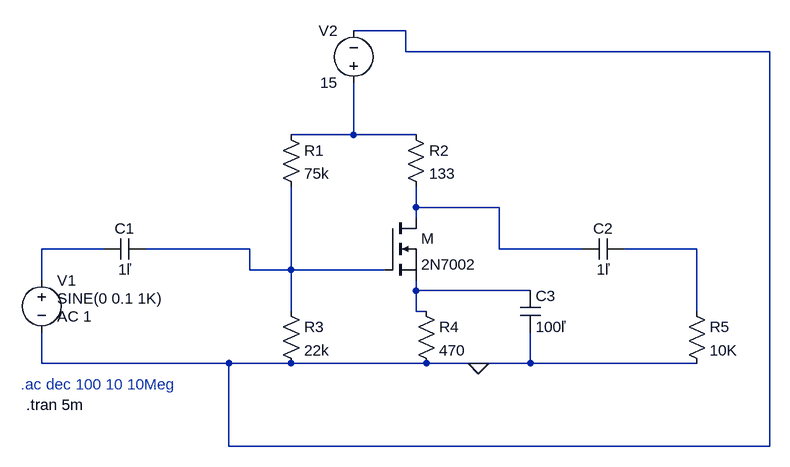
[diagram p0: schematic NNM24EE003_AdarshPoojary.asc]
NNM24EE003_AdarshPoojary.asc, the LTspice schematic file:
Version 4.1
SHEET 1 880 680
WIRE -1200 -752 -1280 -752
WIRE -1200 -720 -1200 -752
WIRE -640 -720 -1200 -720
WIRE -1280 -592 -1280 -672
WIRE -1280 -592 -1376 -592
WIRE -1184 -592 -1280 -592
WIRE -1184 -480 -1184 -512
WIRE -1056 -480 -1184 -480
WIRE -1184 -464 -1184 -480
WIRE -1664 -416 -1760 -416
WIRE -1440 -416 -1600 -416
WIRE -1056 -416 -1056 -480
WIRE -928 -416 -1056 -416
WIRE -752 -416 -864 -416
WIRE -1440 -384 -1440 -416
WIRE -1376 -384 -1376 -512
WIRE -1376 -384 -1440 -384
WIRE -1232 -384 -1376 -384
WIRE -1760 -368 -1760 -416
WIRE -1184 -352 -1184 -368
WIRE -1008 -352 -1184 -352
WIRE -1376 -320 -1376 -384
WIRE -1184 -320 -1184 -352
WIRE -1168 -320 -1184 -320
WIRE -752 -320 -752 -416
WIRE -1760 -240 -1760 -288
WIRE -1472 -240 -1760 -240
WIRE -1376 -240 -1472 -240
WIRE -1168 -240 -1376 -240
WIRE -1088 -240 -1168 -240
WIRE -1008 -240 -1008 -288
WIRE -1008 -240 -1088 -240
WIRE -752 -240 -1008 -240
WIRE -1472 -112 -1472 -240
WIRE -640 -112 -640 -720
WIRE -640 -112 -1472 -112
FLAG -1088 -240 0
SYMBOL cap -1600 -432 R90
WINDOW 0 0 32 VBottom 2
WINDOW 3 32 32 VTop 2
SYMATTR InstName C1
SYMATTR Value 1ľ
SYMBOL cap -864 -432 R90
WINDOW 0 0 32 VBottom 2
WINDOW 3 32 32 VTop 2
SYMATTR InstName C2
SYMATTR Value 1ľ
SYMBOL res -1392 -608 R0
SYMATTR InstName R1
SYMATTR Value 75k
SYMBOL res -1200 -608 R0
SYMATTR InstName R2
SYMATTR Value 133
SYMBOL res -1392 -336 R0
SYMATTR InstName R3
SYMATTR Value 22k
SYMBOL res -1184 -336 R0
SYMATTR InstName R4
SYMATTR Value 470
SYMBOL nmos -1232 -464 R0
SYMATTR InstName M
SYMATTR Value 2N7002
SYMBOL res -768 -336 R0
SYMATTR InstName R5
SYMATTR Value 10K
SYMBOL voltage -1760 -384 R0
WINDOW 3 24 44 Left 2
WINDOW 123 24 72 Left 2
WINDOW 39 0 0 Left 0
SYMATTR Value SINE(0 0.1 1K)
SYMATTR Value2 AC 1
SYMATTR InstName V1
SYMBOL voltage -1280 -656 R180
WINDOW 0 24 96 Left 2
WINDOW 3 24 16 Left 2
WINDOW 123 0 0 Left 0
WINDOW 39 0 0 Left 0
SYMATTR InstName V2
SYMATTR Value 15
SYMBOL cap -1024 -352 R0
SYMATTR InstName C3
SYMATTR Value 100ľ
TEXT -1792 -208 Left 2 ;.ac dec 100 10 10Meg
TEXT -1784 -176 Left 2 !.tran 5m

The netlist it stands for:
* NNM24EE003_AdarshPoojary.asc
C1 N004 N003 1ľ
C2 N005 N002 1ľ
R1 N001 N004 75k
R2 N001 N002 133
R3 N004 0 22k
R4 N006 0 470
M N002 N004 N006 N006 2N7002
R5 N005 0 10K
V1 N003 0 SINE(0 0.1 1K) AC 1
V2 N001 0 15
C3 N006 0 100ľ
.model NMOS NMOS
.model PMOS PMOS
.lib standard.mos
* .ac dec 100 10 10Meg
.tran 5m
.backanno
.end